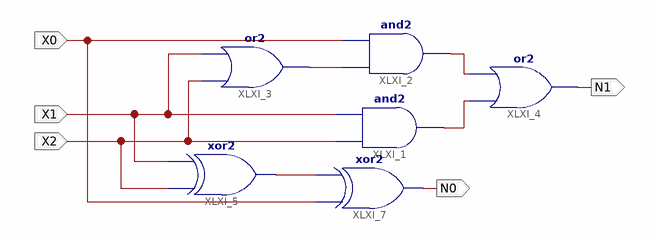
[diagram p0: schematic sheet 1]
// Xilinx ISE schematic CountOne3Bit.sch (spartan3a) as structural Verilog: 6 symbols, 5 ports
module CountOne3Bit (
  input  X0,
  input  X1,
  input  X2,
  output N1,
  output N0
);

  wire XLXN_6, XLXN_13, XLXN_14, XLXN_17;

  and XLXI_1 (XLXN_14, X2, X1);
  and XLXI_2 (XLXN_13, XLXN_6, X0);
  or XLXI_3 (XLXN_6, X2, X1);
  or XLXI_4 (N1, XLXN_14, XLXN_13);
  xor XLXI_5 (XLXN_17, X2, X1);
  xor XLXI_7 (N0, X0, XLXN_17);
endmodule
